# EAGLE schematic VCO eagle (EAGLE 5.11)
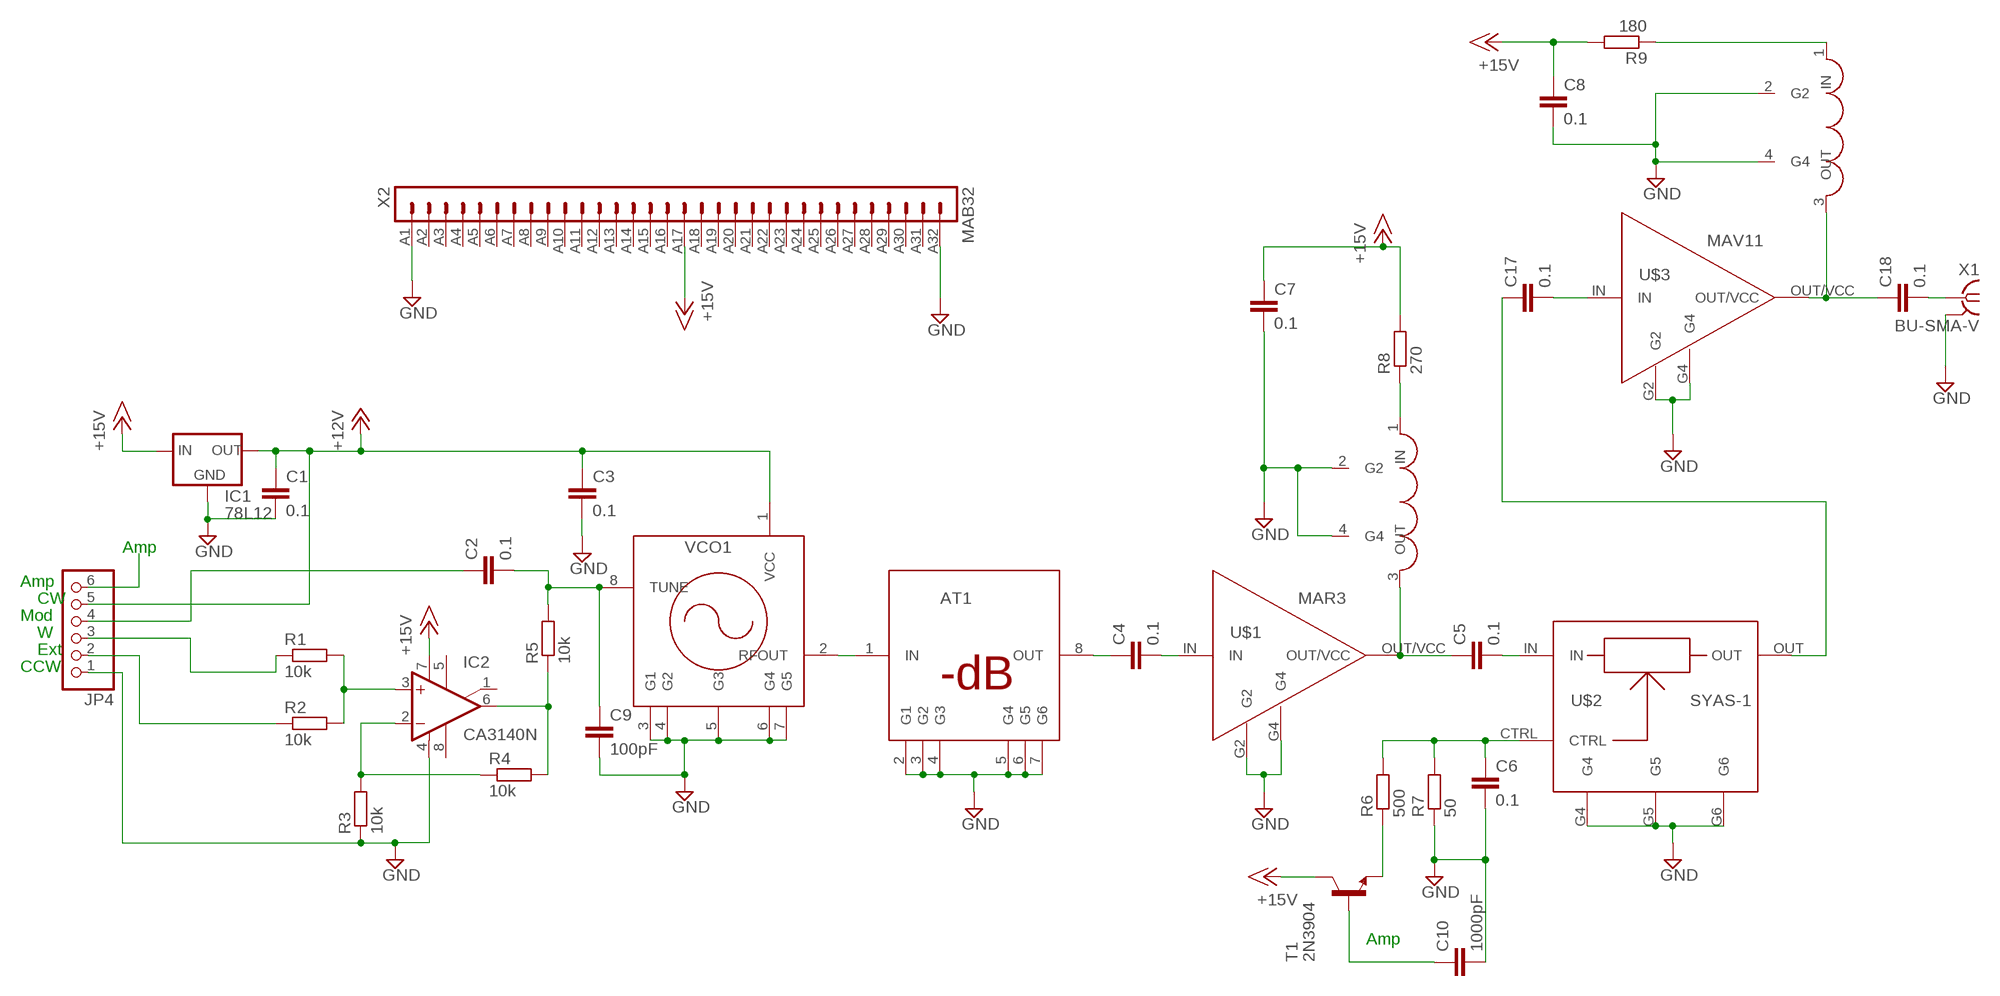
[diagram p0: schematic, sheet 1]

## Parts
AT1  ATXA11  [A11]
C1  0.1  C-EUC1210  [C1210]
C2  0.1  C-EUC1210  [C1210]
C3  0.1  C-EUC1210  [C1210]
C4  0.1  C-EUC1210  [C1210]
C5  0.1  C-EUC1210  [C1210]
C6  0.1  C-EUC1210  [C1210]
C7  0.1  C-EUC1210  [C1210]
C8  0.1  C-EUC1210  [C1210]
C9  100pF  C-EUC0805  [C0805]
C10  1000pF  C-EUC0805  [C0805]
C17  0.1  C-EUC1206  [C1206]
C18  0.1  C-EUC1206  [C1206]
IC1  78L12  78LXX  [78LXX]
IC2  CA3140N  [DIL08]
JP4  PINHD-1X6  [1X06]
R1  10k  R-EU_0204/7  [0204/7]
R2  10k  R-EU_0204/7  [0204/7]
R3  10k  R-EU_0204/7  [0204/7]
R4  10k  R-EU_0204/7  [0204/7]
R5  10k  R-EU_0204/7  [0204/7]
R6  500  R-EU_0204/7  [0204/7]
R7  50  R-EU_0204/7  [0204/7]
R8  270  R-EU_R1206  [R1206]
R9  180  R-EU_R1206  [R1206]
T1  2N3904  [TO92]
U$1  MAR3  [MAR]
U$2  SYAS-1  [TTT166]
U$3  MAV11  [MAR]
U$4  TCCH-80  [PL-147]
U$5  TCCH-80  [PL-147]
VCO1  POS  [A01]
X1  BU-SMA-V  [BU-SMA-V]
X2  MAB32  [MAB32]

## Nets
+12V: C1.1 C3.1 IC1.OUT JP4.5 VCO1.1(VCC)
+15V: C7.1 C8.1 IC1.IN IC2.7(V+) R8.2 R9.2 T1.1(C) X2.A17
AMP: C10.1 JP4.6 T1.2(B)
GND: AT1.2(G1) AT1.3(G2) AT1.4(G3) AT1.5(G4) AT1.6(G5) AT1.7(G6) C1.2 C3.2 C6.2 C7.2 C8.2 C9.2 C10.2 IC1.GND IC2.4(V-) JP4.1 R3.1 R7.1 U$1.G2 U$1.G4 U$2.G4 U$2.G5 U$2.G6 U$3.G2 U$3.G4 U$4.2(G2) U$4.4(G4) U$5.2(G2) U$5.4(G4) VCO1.3(G1) VCO1.4(G2) VCO1.5(G3) VCO1.6(G4) VCO1.7(G5) X1.2(GND) X2.A1 X2.A32
N$31: R6.1 T1.3(E)
N$33: JP4.2 R2.1
N$34: IC2.3(+IN) R1.2 R2.2
N$35: IC2.2(-IN) R3.2 R4.1
N$36: IC2.6(OUT) R4.2 R5.1
N$37: C6.1 R6.2 R7.2 U$2.CTRL
N$38: C2.1 JP4.4
N$39: C2.2 C9.1 R5.2 VCO1.8(TUNE)
N$40: R9.1 U$5.1(IN)
N$41: AT1.1(IN) VCO1.2(RFOUT)
N$42: AT1.8(OUT) C4.1
N$43: C4.2 U$1.IN
N$44: C5.1 U$1.OUT/VCC U$4.3(OUT)
N$45: C5.2 U$2.IN
N$46: C17.2 U$3.IN
N$47: C18.1 U$3.OUT/VCC U$5.3(OUT)
N$48: R8.1 U$4.1(IN)
N$49: C17.1 U$2.OUT
N$50: C18.2 X1.1
N$51: JP4.3 R1.1
Unconnected: IC2.1(ON/CMP) IC2.5(ON) IC2.8(CMP) X2.A2 X2.A3 X2.A4 X2.A5 X2.A6 X2.A7 X2.A8 X2.A9 X2.A10 X2.A11 X2.A12 X2.A13 X2.A14 X2.A15 X2.A16 X2.A18 X2.A19 X2.A20 X2.A21 X2.A22 X2.A23 X2.A24 X2.A25 X2.A26 X2.A27 X2.A28 X2.A29 X2.A30 X2.A31

## Notes on the sheet
- Amp
- Amp
- CW
- Mod
- W
- Ext
- CCW
- Amp

## Power pins joined to a net without a drawn wire
GND: X1.3(GND) X1.4(GND) X1.5(GND)

## Library data of the parts
AT1 = minicircuits:ATX: MiniCircuits fixed attenuators in through hole package
C1-C10 C17 C18 = rcl:C-EU: CAPACITOR, European symbol
IC1 = v-reg:78LXX: VOLTAGE REGULATOR
IC2 = linear:CA3140: OP AMP
JP4 = pinhead:PINHD-1X6: PIN HEADER
R1-R9 = rcl:R-EU_: RESISTOR, European symbol
T1 = transistor:2N3904: NPN TRANSISTOR
U$1 = minicircuits:MAR3: MiniCircuits MAR-3+ amplifier
U$2 = minicircuits:SYAS-1: MiniCircuits voltage variable attenuator
U$3 = minicircuits:MAV11: MiniCircuits MAV-11 amplifer, currently identical to MAR-3
U$4 U$5 = minicircuits:TCCH-80: MiniCircuits TCCH-80+ choke
VCO1 = minicircuits:POS: MiniCircuits POS-x VCO, through hole package
X1 = con-coax:BU-SMA-V: FEMALE SMA CONNECTOR Radiall distributor RS 112-3794
X2 = con-vg:MAB32: CONNECTOR male, 32 pins, type B, row A, grid 2.54 mm